# Altium project Coil Gun Mk4.PrjPcb
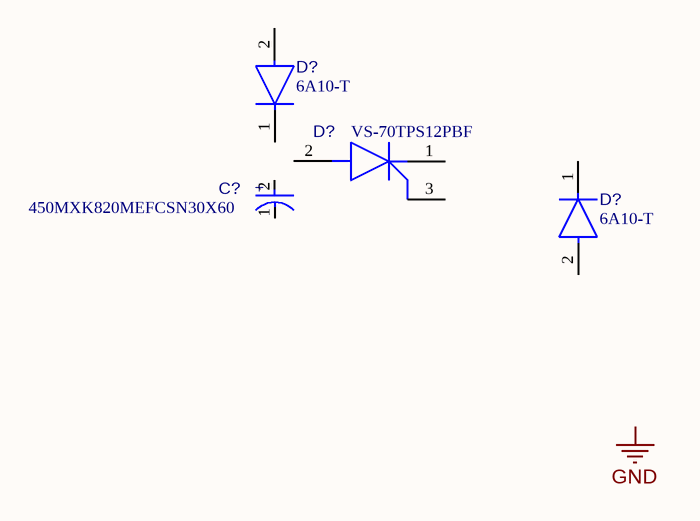
[diagram p0: Main.SchDoc]
1 sheet, 4 parts. Net scope: global (net labels, ports and power ports of the same name join across sheets).

## Sheet Main.SchDoc
size A0; SheetNumber: 1; SheetTotal: 1

### Parts
(Parts that share a designator on the sheet are numbered #1, #2 ... from top to bottom, then left to right.)
C?  450MXK820MEFCSN30X60  [FP-450MXK820MEFCSN30X60-MFG]
D?#1  6A10-T  [FP-R-6-MFG]
D?#2  VS-70TPS12PBF  [FP-VS-70TPS12PBF-0]
D?#3  6A10-T  [FP-R-6-MFG]

### Nets

Not connected (* = marked no-connect by the designer): C? 1(C) 2(A); D?#1 1(C) 2(A); D?#2 1(K) 2(A) 3(G); D?#3 1(C) 2(A)

### Notes on the sheet
- Labels drawn without touching a wire or pin: GND
- (in symbol CMP-35376-000031-1) +

### Library data of the parts
C? = CMP-35376-000031-1: CAP ALUM 820UF 20% 450V SNAP; RoHS Compliant: Yes
D?#1 D?#3 = CMP-12791-000038-1: DIODE GEN PURP 1KV 6A R6; Manufacturer: Diodes Inc.; Max Surge Forward Current: 400A; Reverse Voltage: 1000V; Max Junction Temp: +175°C; Peak Reverse Current: 10uA; Temperature Range High: +175°C; Device Class L1: Discrete Semiconductors; Temperature: -65°C to +175°C; Lead Free: Yes; ComponentLink2URL: https://www.diodes.com/assets/Datasheets/ds28009.pdf; RoHS: TRUE; Height: 9.1mm; Forward Current: 6A; Category: Diode; Ipc Land Pattern Name: DIOAD2054W145L885D885; Max Repetitive Reverse Voltage: 1000V; Mouser Description: Rectifiers 1000V 6A; Footprint Url: https://www.diodes.com/assets/Package-Files/R-6.pdf; ComponentLink2Description: Datasheet; Octopart: https://octopart.com/6a10-t-diodes+inc.-55426548; Device Class L2: Diodes; Temperature Range Low: -65°C; Package: R-6; Automotive: No; Digikey Description: DIODE GEN PURP 1KV 6A R6; Manufacturer Part Number: 6A10-T; Device Class L3: Rectifier Diodes
D?#2 = CMP-02544-000003-1: SCR 1.2KV 75A SUPER-247; Hold Current: 200mA; Forward Voltage: 1.4V; Current Rating: 70A; RoHS Compliant: Yes; Min Operating Temperature: -40°C; Mount: Through Hole; Weight: 0.211644oz; Radiation Hardening: No; Series: -; Max Operating Temperature: 125°C; Packaging: Bulk; Package Quantity: 500; Length: 16.1mm; Max Repetitive Reverse Voltage (Vrrm): 1.2kV; Width: 5.5mm; RMS Current (Irms): 75A; Height: 20.8mm; Case/Package: TO-247; Number of Pins: 247; Contact Plating: Tin